# Altium schematic sheet WS2811.SchDoc
size A4
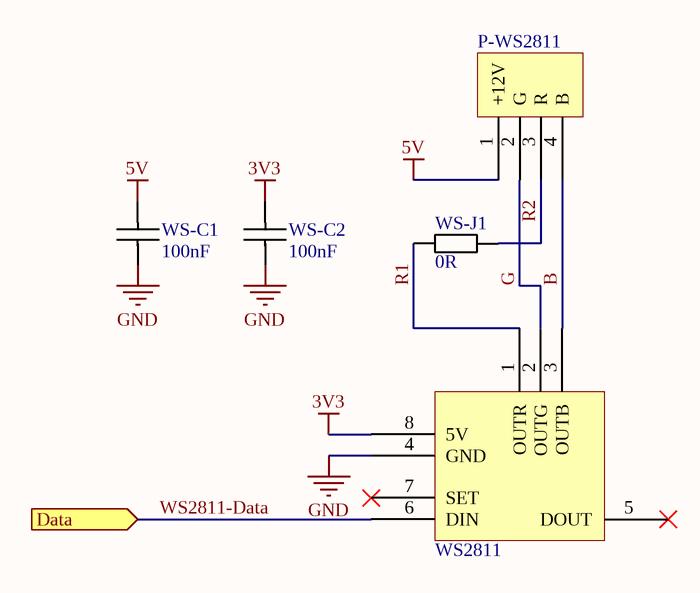
[diagram p0: WS2811.SchDoc]

## Parts
P-WS2811  LED strip RGB  [LED strip RGB connector]  (value not drawn)
WS2811  WS2811S  [SOIC-8]  (value not drawn)
WS-C1  100nF  [C 0805 / 2012]
WS-C2  100nF  [C 0805 / 2012]
WS-J1  0R  [R 0805 / 2012 wide]

## Ports
Data (in)

## Nets
3V3: WS2811.8(5V) WS-C2.1
5V: P-WS2811.1(+12V) WS-C1.1
GND: WS2811.4(GND) WS-C1.2 WS-C2.2
B: P-WS2811.4(B) WS2811.3(OUTB)
G: P-WS2811.2(G) WS2811.2(OUTG)
R1: WS2811.1(OUTR) WS-J1.1
R2: P-WS2811.3(R) WS-J1.2
WS2811-Data: WS2811.6(DIN) ; port Data

Not connected (* = marked no-connect by the designer): WS2811 5(DOUT)* 7(SET)*

## Library data of the parts
WS2811 = WS2811S: RGB LED Controller
WS-C1 WS-C2 = Capacitor
WS-J1 = Resistor